# EAGLE design fabftdi-tiny2313 (EAGLE 8.2.1)
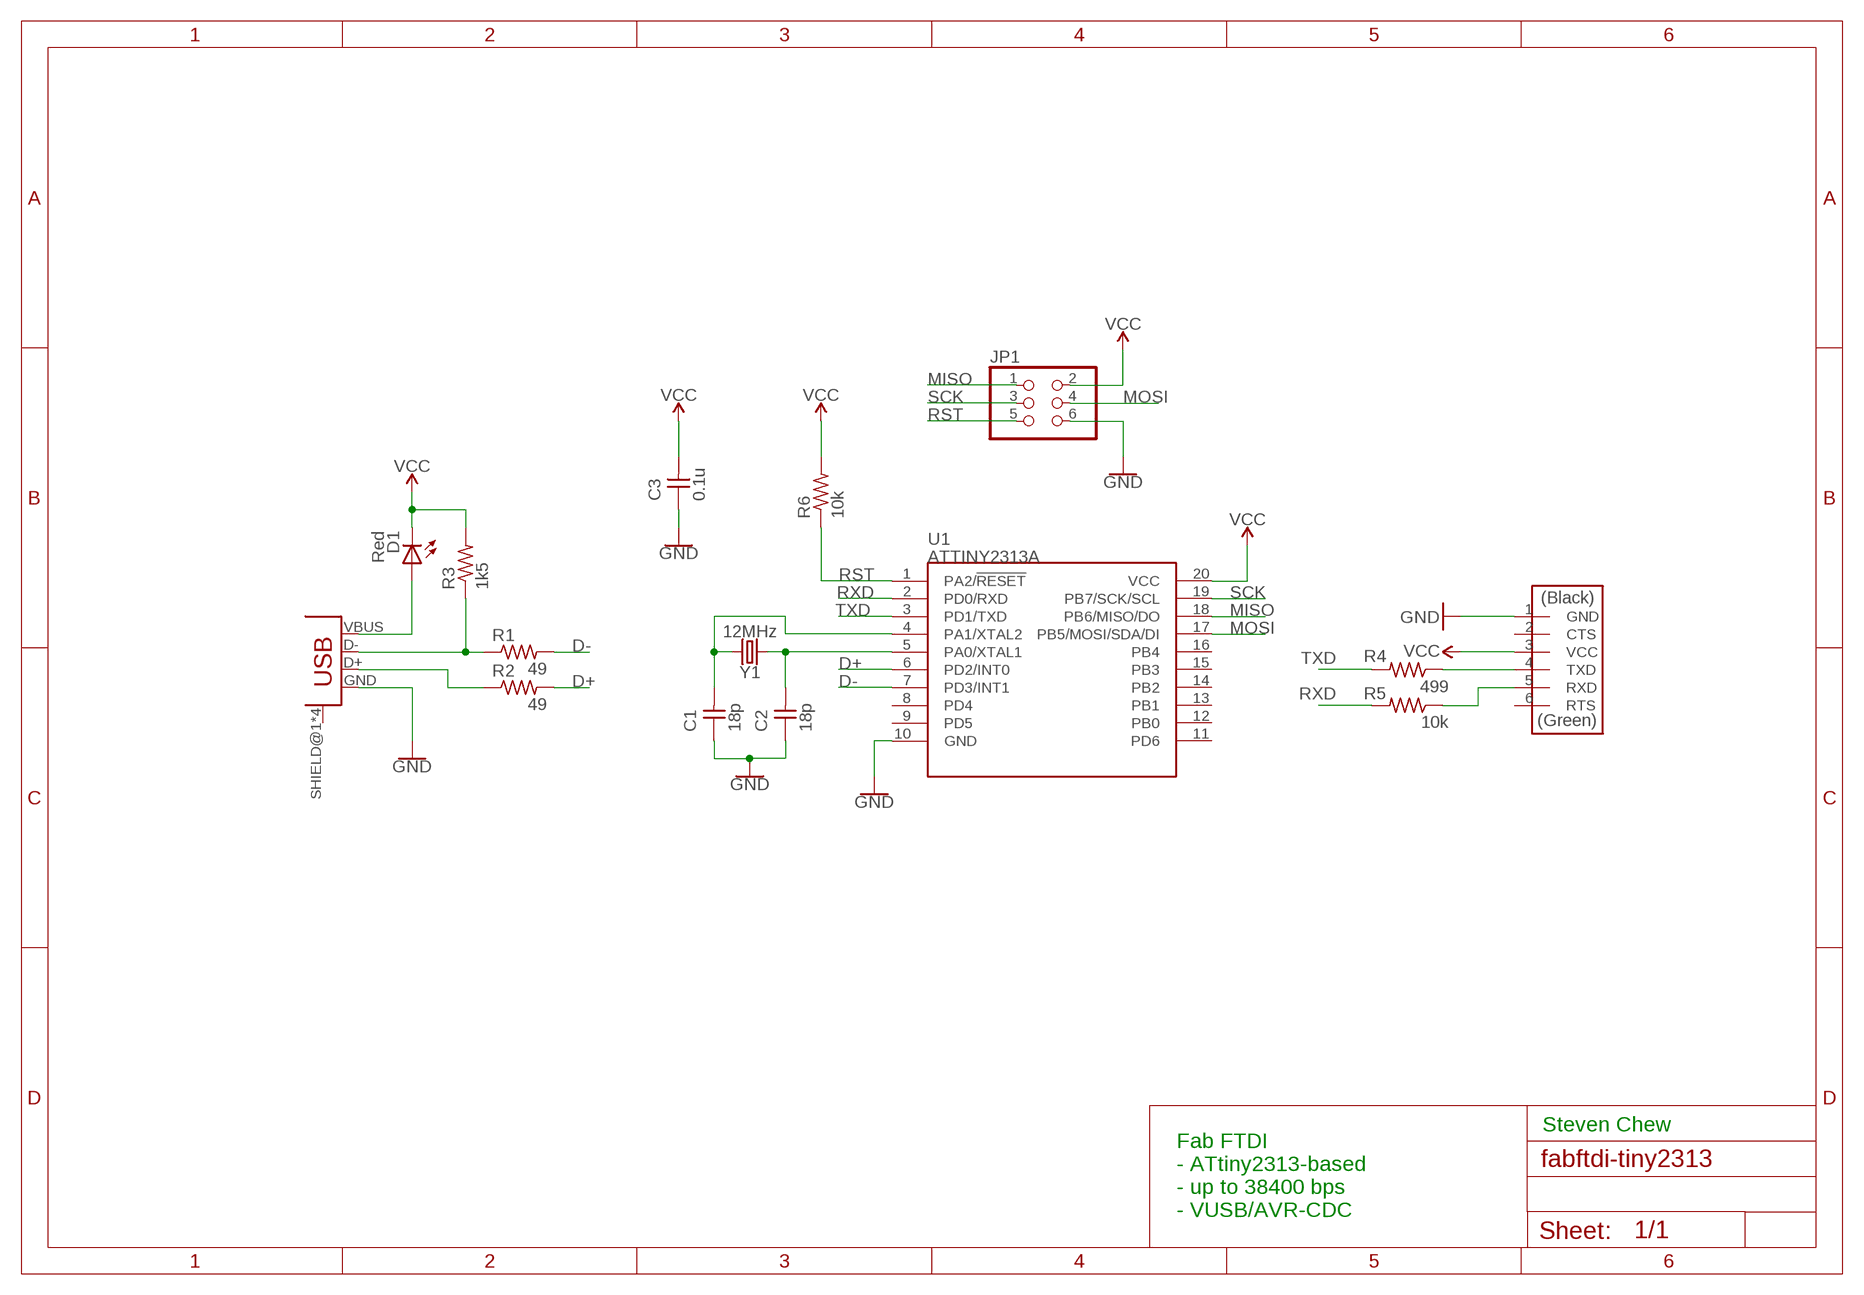
[diagram p0: schematic, sheet 1]

## Parts
C1  18p  CAP-UNPOLARIZEDFAB  [C1206FAB]
C2  18p  CAP-UNPOLARIZEDFAB  [C1206FAB]
C3  0.1u  CAP-UNPOLARIZEDFAB  [C1206FAB]
D1  Red  LEDFAB1206  [LED1206FAB]
JP1  PINHD-2X3-SMDFAB  [2X03SMD-FAB]
JP2  FTDI-SMD-HEADER  [1X06SMD]
R1  49  RES-US1206FAB  [R1206FAB]
R2  49  RES-US1206FAB  [R1206FAB]
R3  1k5  RES-US1206FAB  [R1206FAB]
R4  499  RES-US1206FAB  [R1206FAB]
R5  10k  RES-US1206FAB  [R1206FAB]
R6  10k  RES-US1206FAB  [R1206FAB]
U1  ATTINY2313A  [SOP20W]
U2  USB_MINI  [USB_MINI]
Y1  12MHz  CRYSTALSMD-HC49UP  [HC49UP]

## Nets
D+: R2.2 U1.6(PD2/INT0)
D-: R1.2 U1.7(PD3/INT1)
GND: C1.1 C2.1 C3.1 JP1.6 JP2.1(GND) U1.10(GND) U2.GND
MISO: JP1.1 U1.18(PB6/MISO/DO)
MOSI: JP1.4 U1.17(PB5/MOSI/SDA/DI)
N$1: D1.1(A) U2.VBUS
N$2: C2.2 U1.5(PA0/XTAL1) Y1.1
N$3: C1.2 U1.4(PA1/XTAL2) Y1.2
N$7: JP2.4(TXD) R4.1
N$8: JP2.5(RXD) R5.1
N$13: R1.1 R3.1 U2.D-
N$14: R2.1 U2.D+
RST: JP1.5 R6.1 U1.1(PA2/!RESET)
RXD: R5.2 U1.2(PD0/RXD)
SCK: JP1.3 U1.19(PB7/SCK/SCL)
TXD: R4.2 U1.3(PD1/TXD)
VCC: C3.2 D1.2(C) JP1.2 JP2.3(VCC) R3.2 R6.2 U1.20(VCC)
Unconnected: JP2.2(CTS) JP2.6(RTS) U1.8(PD4) U1.9(PD5) U1.11(PD6) U1.12(PB0) U1.13(PB1) U1.14(PB2) U1.15(PB3) U1.16(PB4) U2.SHIELD@1(SHIELD) U2.SHIELD@2(SHIELD) U2.SHIELD@3(SHIELD) U2.SHIELD@4(SHIELD)

## Notes on the sheet
- Steven Chew
- Fab FTDI
  - ATtiny2313-based
  - up to 38400 bps
  - VUSB/AVR-CDC

## Library data of the parts
C1-C3 = 00fab:CAP-UNPOLARIZED
D1 = 00fab:LED: LED
JP1 = 00fab:PINHD-2X3-SMD: PIN HEADER
JP2 = 00fab:FTDI-SMD-HEADER
R1-R6 = 00fab:RES-US: Resistor (US Symbol) Variants with postfix FAB are widened to allow the routing of internal traces
U1 = SparkFun-IC-Microcontroller:ATTINY2313A: ATTINY2313A 2kB 20MHz I2C/SPI/UART Datasheet <https://cdn.sparkfun.com/datasheets/Widgets/ATtiny2313A.pdf> SparkFun Products SparkFun Wake on Shake <https://www.sparkfun.com/products/11447> (SEN-11447); PROD_ID: IC-11305
U2 = 00fab:USB_MINI
Y1 = SparkFun-Clocks:CRYSTAL: Crystals (Generic) These are passive quartz crystals, which can be used as a clock source for a microcontroller. Crystal's are two-terminal devices. They require external "load" capacitors to generate an oscillating signal.

## Board
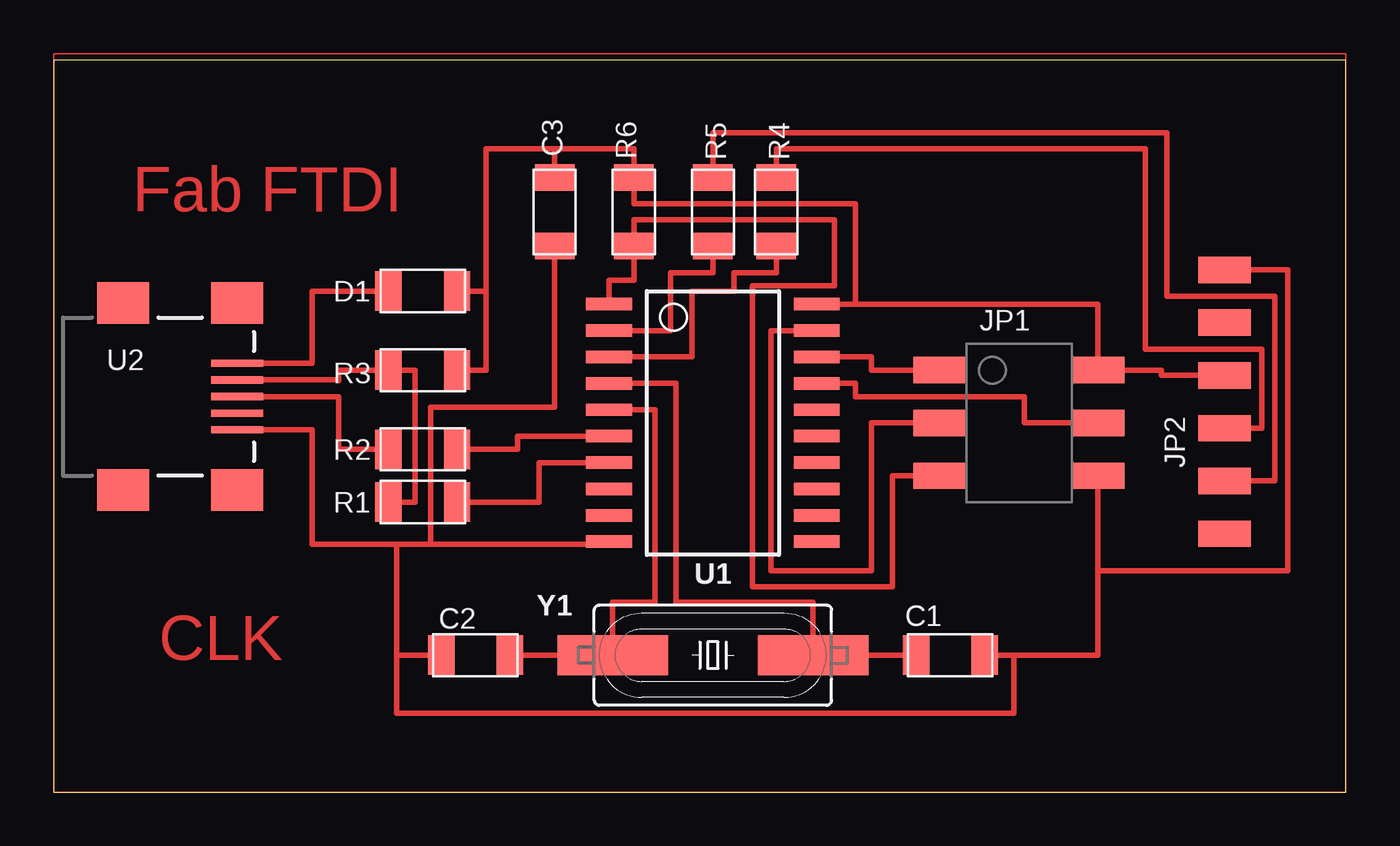
[diagram p1: board, top side]

Size 62.21 x 35.23 mm. Coordinates in mm from the lower left corner, seen from the top.
Outline: 0,0 62.21,0 62.21,35.23 0,35.23 0,0
Copper layers (1*16): Top 0.035mm / dielectric 1.5mm / Bottom 0.035mm
Design rules "default *": minimum track width 6mil, minimum drill 0.35mm, track to track 12mil, track to pad 12mil, pad to pad 12mil, via to via 6mil, smd to smd 8mil, copper to edge 40mil, drill to drill 6mil, minimum pad ring 10mil, minimum via ring 8mil, stop-mask expansion 4mil, vias tented up to drill 0mil, thermal gap 10mil

### Footprints (pad centres in the part's own frame; a part is rotated, then mirrored left to right if it is on the bottom)
C1206FAB = smd 1.27 x 1.905: 1 -1.651,0; 2 1.651,0
LED1206FAB = smd 1.27 x 1.905: 1 -1.651,0; 2 1.651,0
2X03SMD-FAB = smd 2.54 x 1.27: 1 -3.81,2.54; 2 3.81,2.54; 3 -3.81,0; 4 3.81,0; 5 -3.81,-2.54; 6 3.81,-2.54
1X06SMD = smd 2.54 x 1.27: 1 0,6.35; 2 0,3.81; 3 0,1.27; 4 0,-1.27; 5 0,-3.81; 6 0,-6.35
R1206FAB = smd 1.27 x 1.905: 1 -1.651,0; 2 1.651,0
SOP20W = smd 0.6 x 2.2: 1 -5.715,-5; 2 -4.445,-5; 3 -3.175,-5; 4 -1.905,-5; 5 -0.635,-5; 6 0.635,-5; 7 1.905,-5; 8 3.175,-5; 9 4.445,-5; 10 5.715,-5; 11 5.715,5; 12 4.445,5; 13 3.175,5; 14 1.905,5; 15 0.635,5; 16 -0.635,5; 17 -1.905,5; 18 -3.175,5; 19 -4.445,5; 20 -5.715,5
USB_MINI = smd 2.5 x 0.35: D+ 3.77,0; D- 3.77,0.8; GND 3.77,-1.6; ID 3.77,-0.8; VBUS 3.77,1.6 | smd 2.5 x 2: SHIELD@1 -1.73,-4.5; SHIELD@2 -1.73,4.5; SHIELD@3 3.77,4.5; SHIELD@4 3.77,-4.5
HC49UP = smd 5.334 x 1.93: 1 -4.826,0; 2 4.826,0

### Placement (x,y rotation side)
C1  43.18,6.6 180 top
C2  20.32,6.6 0 top
C3  24.13,27.94 90 top
D1  17.78,24.13 0 top
JP1  46.48,17.78 0 top
JP2  56.39,18.8 0 top
R1  17.78,13.97 0 top
R2  17.78,16.51 0 top
R3  17.78,20.32 0 top
R4  34.8,27.94 270 top
R5  31.75,27.94 270 top
R6  27.94,27.94 90 top
U1  31.75,17.78 270 top
U2  5.08,19.05 0 top
Y1  31.75,6.6 0 top

### Tracks (layer width: path | path; a pad name or v marks a point on that pad's centre or on a via)
D+
  Top 0.254: U1.6 22.35,17.14 22.35,16.51 R2.2
D-
  Top 0.254: U1.7 23.37,15.88 23.37,13.97 R1.2
GND
  Top 0.254: U2.GND 12.45,17.45 12.45,11.94 16.51,11.94 | 18.16,11.94 16.51,11.94 | 18.16,11.94 26.75,11.94 U1.10 | C2.1 16.51,6.6 | 16.51,6.6 16.51,11.94 | C3.1 24.13,18.54 18.16,18.54 18.16,11.94 | 16.51,6.6 16.51,3.81 46.23,3.81 46.23,6.6 | 46.23,6.6 C1.1 | 46.23,6.6 50.29,6.6 50.29,10.67 | JP1.6 50.29,10.92 50.29,10.67 | JP2.1 59.44,25.15 59.44,10.67 50.29,10.67
MISO
  Top 0.254: U1.18 39.37,20.95 39.37,20.32 JP1.1
MOSI
  Top 0.254: U1.17 38.61,19.68 38.61,19.05 46.74,19.05 46.74,17.78 JP1.4
N$1
  Top 0.254: U2.VBUS 12.45,20.65 12.45,24.13 D1.1
N$2
  Top 0.254: C2.2 Y1.1 26.92,9.14 28.96,9.14 28.96,18.41 U1.5
N$3
  Top 0.254: C1.2 Y1.2 36.58,9.14 29.97,9.14 29.97,19.68 U1.4
N$4
  Top 0.076: 0,0 62.23,0 62.23,35.56 0,35.56 0,0
N$7
  Top 0.254: R4.1 34.8,30.99 52.58,30.99 52.58,21.34 58.17,21.34 58.17,17.53 JP2.4
N$8
  Top 0.254: R5.1 31.75,31.75 53.59,31.75 53.59,23.88 58.8,23.88 58.8,14.99 JP2.5
N$13
  Top 0.254: U2.D- 13.72,19.85 | 13.72,19.85 13.72,19.81 | 13.72,19.85 13.72,20.32 R3.1 17.4,20.32 17.4,13.97 R1.1
N$14
  Top 0.254: U2.D+ 13.72,19.05 13.72,16.51 R2.1
RST
  Top 0.254: U1.1 26.75,24.64 27.94,24.64 R6.1 27.94,27.56 37.59,27.56 37.59,24.38 33.66,24.38 33.66,9.91 40.39,9.91 40.39,15.24 JP1.5
RXD
  Top 0.254: U1.2 29.72,22.23 29.72,25.02 31.75,25.02 R5.2
SCK
  Top 0.254: U1.19 34.54,22.23 34.54,10.67 39.37,10.67 39.37,17.78 JP1.3
TXD
  Top 0.254: U1.3 30.73,20.95 30.73,24.13 32.77,24.13 32.77,25.02 34.8,25.02 R4.2
VCC
  Top 0.254: D1.2 20.83,24.13 | 20.83,24.13 20.83,20.32 R3.2 | 20.83,24.13 20.83,30.99 24.13,30.99 | 24.13,30.99 27.94,30.99 R6.2 27.94,28.32 38.61,28.32 38.61,23.5 | C3.2 24.13,30.99 | U1.20 38.61,23.5 | JP2.3 53.34,20.07 53.34,20.32 JP1.2 50.29,23.5 38.61,23.5

### Text on the board
Top: Fab FTDI | CLK